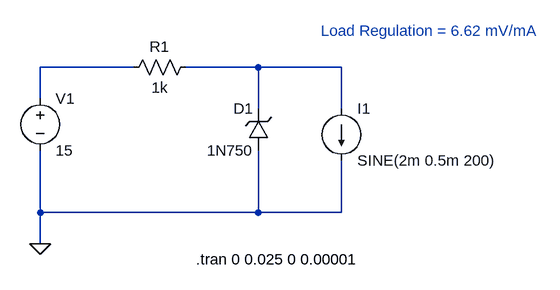
[diagram p0: schematic 19201063_Lab3_Regulator.asc]
19201063_Lab3_Regulator.asc, the LTspice schematic file:
Version 4
SHEET 1 880 680
WIRE 224 64 80 64
WIRE 416 64 304 64
WIRE 544 64 416 64
WIRE 80 112 80 64
WIRE 416 128 416 64
WIRE 544 128 544 64
WIRE 80 288 80 192
WIRE 416 288 416 192
WIRE 416 288 80 288
WIRE 544 288 544 208
WIRE 544 288 416 288
WIRE 80 336 80 288
FLAG 80 336 0
SYMBOL voltage 80 96 R0
WINDOW 123 0 0 Left 0
WINDOW 39 0 0 Left 0
SYMATTR InstName V1
SYMATTR Value 15
SYMBOL res 320 48 R90
WINDOW 0 0 56 VBottom 2
WINDOW 3 32 56 VTop 2
SYMATTR InstName R1
SYMATTR Value 1k
SYMBOL zener 432 192 R180
WINDOW 0 24 64 Left 2
WINDOW 3 24 0 Left 2
SYMATTR InstName D1
SYMATTR Value 1N750
SYMBOL current 544 128 R0
WINDOW 123 0 0 Left 0
WINDOW 39 0 0 Left 0
SYMATTR InstName I1
SYMATTR Value SINE(2m 0.5m 200)
TEXT 320 360 Left 2 !.tran 0 0.025 0 0.00001
TEXT 512 8 Left 2 ;Load Regulation = 6.62 mV/mA

The netlist it stands for:
* 19201063_Lab3_Regulator.asc
V1 N001 0 15
R1 N002 N001 1k
D1 0 N002 1N750
I1 N002 0 SINE(2m 0.5m 200)
.model D D
.lib standard.dio
.tran 0 0.025 0 0.00001
* Load Regulation = 6.62 mV/mA
.backanno
.end